# Altium schematic sheet Sheet1.SchDoc: Pumchi Musikaya
size A4; Author: Akhila Wedamestrige; DrawnBy: Akhila Wedamestrige; SheetNumber: 1; SheetTotal: 1
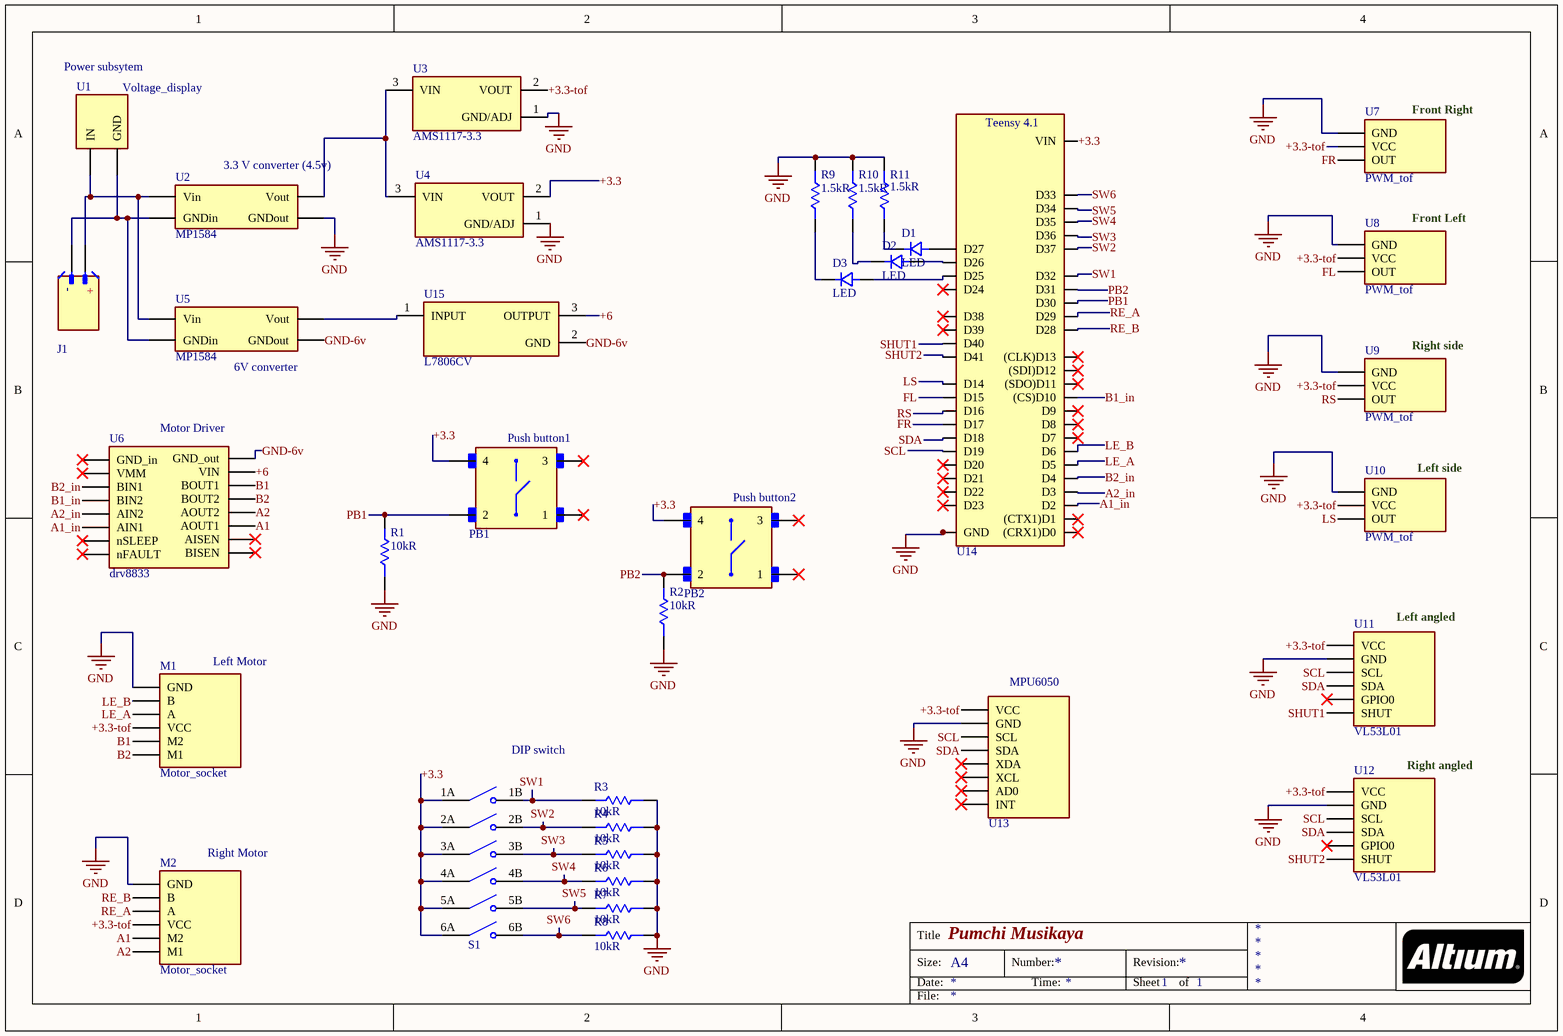
[diagram p0: Sheet1.SchDoc]

## Parts
D1  LED  [150080RS75000]
D2  LED  [150080RS75000]
D3  LED  [150080RS75000]
J1  Power_jack  [Power_jack]  (value not drawn)
M1  Motor_socket  [Motor_socket]
M2  Motor_socket  [Motor_socket]
PB1  Push_button  [Push_button]  (value not drawn)
PB2  Push_button  [Push_button]  (value not drawn)
R1  value 10kR  [RC0805JR-0710KL]  (hidden comment: RC0805JR-0710KL)
R2  value 10kR  [RC0805JR-0710KL]  (hidden comment: RC0805JR-0710KL)
R3  value 10kR  [RC0805JR-0710KL]  (hidden comment: RC0805JR-0710KL)
R4  value 10kR  [RC0805JR-0710KL]  (hidden comment: RC0805JR-0710KL)
R5  value 10kR  [RC0805JR-0710KL]  (hidden comment: RC0805JR-0710KL)
R6  value 10kR  [RC0805JR-0710KL]  (hidden comment: RC0805JR-0710KL)
R7  value 10kR  [RC0805JR-0710KL]  (hidden comment: RC0805JR-0710KL)
R8  value 10kR  [RC0805JR-0710KL]  (hidden comment: RC0805JR-0710KL)
R9  value 1.5kR  [RC0805FR-071K5L]  (hidden comment: RC0805FR-071K5L)
R10  value 1.5kR  [RC0805FR-071K5L]  (hidden comment: RC0805FR-071K5L)
R11  value 1.5kR  [RC0805FR-071K5L]  (hidden comment: RC0805FR-071K5L)
S1  DIP_switch  [DIP_switch]  (value not drawn)
U1  Voltage_display  [Voltage_display]
U2  MP1584  [MP1584]
U3  AMS1117-3.3  [AMS1117-3.3]
U4  AMS1117-3.3  [AMS1117-3.3]
U5  MP1584  [MP1584]
U6  drv8833  [drv8833]
U7  PWM_tof  [P_tof]
U8  PWM_tof  [P_tof]
U9  PWM_tof  [P_tof]
U10  PWM_tof  [P_tof]
U11  VL53L01  [VL530L01]
U12  VL53L01  [VL530L01]
U13  MPU6050  [MPU6050]  (value not drawn)
U14  teensy4.1  [teensy4.1]  (value not drawn)
U15  L7806CV  [L7806CV]

## Nets
GND: M1.GND M2.GND R1.1 R2.1 R3.1 R4.1 R5.1 R6.1 R7.1 R8.1 R9.1 R10.1 R11.1 U2.GNDout U3.1(GND/ADJ) U4.1(GND/ADJ) U7.01(GND) U8.01(GND) U9.01(GND) U10.01(GND) U11.02(GND) U12.02(GND) U13.02(GND) U14.AGND/GND(GND) U14.GND U14.GND@2(GND)
+3.3: PB1.4 PB2.4 S1.1A(COM1) S1.2A(COM2) S1.3A(COM3) S1.4A(COM4) S1.5A(COM5) S1.6A(COM6) U4.2(VOUT) U14.VIN
+3.3-tof: M1.VCC M2.VCC U3.2(VOUT) U7.02(VCC) U8.02(VCC) U9.02(VCC) U10.02(VCC) U11.01(VCC) U12.01(VCC) U13.01(VCC)
+6: U6.VIN U15.3(OUTPUT)
A1: M2.M2 U6.AOUT1
A1_in: U6.AIN1 U14.D2
A2: M2.M1 U6.AOUT2
A2_in: U6.AIN2 U14.D3
B1: M1.M2 U6.BOUT1
B1_in: U6.BIN2 U14.D10((CS)D10)
B2: M1.M1 U6.BOUT2
B2_in: U6.BIN1 U14.D4
FL: U8.03(OUT) U14.D15
FR: U7.03(OUT) U14.D17
GND-6v: U5.GNDout U6.GND_out U15.2(GND)
LE_A: M1.A U14.D5
LE_B: M1.B U14.D6
LS: U10.03(OUT) U14.D14
PB1: PB1.2 R1.2 U14.D30
PB2: PB2.2 R2.2 U14.D31
RE_A: M2.A U14.D29
RE_B: M2.B U14.D28
RS: U9.03(OUT) U14.D16
SCL: U11.03(SCL) U12.03(SCL) U13.03(SCL) U14.D19
SDA: U11.04(SDA) U12.04(SDA) U13.04(SDA) U14.D18
SHUT1: U11.06(SHUT) U14.D40
SHUT2: U12.06(SHUT) U14.D41
SW1: R3.2 S1.1B(NO1) U14.D32
SW2: R4.2 S1.2B(NO2) U14.D37
SW3: R5.2 S1.3B(NO3) U14.D36
SW4: R6.2 S1.4B(NO4) U14.D35
SW5: R7.2 S1.5B(NO5) U14.D34
SW6: R8.2 S1.6B(NO6) U14.D33
NetD1_1: D1.1 U14.D27
NetD1_2: D1.2 R11.2
NetD2_1: D2.1 U14.D26
NetD2_2: D2.2 R10.2
NetD3_1: D3.1 U14.D25
NetD3_2: D3.2 R9.2
NetJ1_1: J1.1 U1.IN U2.Vin U5.Vin
NetJ1_2: J1.2 U1.GND U2.GNDin U5.GNDin
NetU2_Vout: U2.Vout U3.3(VIN) U4.3(VIN)
NetU5_Vout: U5.Vout U15.1(INPUT)

Not connected (* = marked no-connect by the designer): PB1 1* 3*; PB2 1* 3*; U6 AISEN* BISEN* GND_in* nFAULT* nSLEEP* VMM*; U11 05(GPIO0)*; U12 05(GPIO0)*; U13 05(XDA)* 06(XCL)* 07(AD0)* 08(INT)*; U14 D0((CRX1)D0)* D1((CTX1)D1)* D7* D8* D9* D11((SDO)D11)* D12((SDI)D12)* D13((CLK)D13)* D20* D21* D22* D23* D24* D38* D39*

## Notes on the sheet
- Power subsytem
- (near U7) Front Right
- (near U2) 3.3 V converter (4.5v)
- Front Left
- (near U5) 6V converter
- (near U9) Right side
- (near U6) Motor Driver
- (near PB1) Push button1
- (near PB2) Push button2
- Left side
- (near U11) Left angled
- Left Motor
- (near U13) MPU6050
- DIP switch
- Right angled
- (near M2) Right Motor
- Title
- Size:
- Date:
- A4
- Number:
- Time:
- Revision:
- Sheet
- of
- File:
- (in symbol Power_jack) -; +
- (in symbol teensy4.1) Teensy 4.1

## Library data of the parts
D1-D3 = 150080RS75000: Single Color LED, Red, Water Clear, 1.4mm; Manufacturer: Wurth Electronics; Shape: Rectangular; Forward Current: 30mA; Luminous Intensity-Nom: 150mcd; Channels: 1; Viewing Angle: 140°; Overall Height: 0.7mm; Supplier: Digikey; Supplier Part Number: 732-4984-1-ND; Manufacturer Part Number: 150080RS75000; RoHS: Yes; Category: LEDs; Stock: 56216; Pricing: 1=0.19, 50=0.176, 100=0.151, 500=0.14688 (USD); Mounting Technology: Surface Mount; Pins: 2; Color: Red; Min Operating Temperature: -40°C; Max Operating Temperature: 85°C; Lens Style: WATER CLEAR; Optoelectronic Device Type: SINGLE COLOR LED; Packaging: Tape and Reel; Size: 1.4mm; Terminal Pitch: 2.1mm; Reach SVHC Compliant: Yes; RoHS Compliant: Yes; ComponentLink1URL: https://datasheet.ciiva.com:443/pdfs/VipMasterIC/IC/MIDC/MIDC-S-A0007455974/MIDC-S-A0007455974-1.pdf?src-supplier=IHS+Markit; ComponentLink1Description: https://datasheet.ciiva.com:443/pdfs/VipMasterIC/IC/MIDC/MIDC-S-A0007455974/MIDC-S-A0007455974-1.pdf?src-supplier=IHS+Markit; ComponentLink2URL: https://datasheet.ciiva.com/22656/150080rs75000-22656961.pdf?src-supplier=Element14; ComponentLink2Description: https://datasheet.ciiva.com/22656/150080rs75000-22656961.pdf?src-supplier=Element14; ComponentLink3URL: https://datasheet.ciiva.com/29279/759435-da-01-en-chipled-0805-w-kl-rot-150080rs75000-29279032.pdf?src-supplier=Conrad; ComponentLink3Description: https://datasheet.ciiva.com/29279/759435-da-01-en-chipled-0805-w-kl-rot-150080rs75000-29279032.pdf?src-supplier=Conrad
R1-R8 = RC0805JR-0710KL: Fixed Resistor, Metal Glaze/thick Film, 0.125W, 10000ohm, 150V, 5% +/-Tol, 100ppm/Cel, Surface Mount, 0805; Manufacturer: Yageo; Additional Feature: LASER TRIMMABLE; Power: 125mW; Rated Temperature: 70°C; Temperature Coefficient (ppm/Cel): 100; Package Height: 0.5mm; Package Length: 2mm; Package Width: 1.25mm; Supplier: Avnet; Supplier Part Number: 80K7383; Manufacturer Part Number: RC0805JR-0710KL; RoHS: Yes; Category: Chip SMD Resistors; Stock: 270; Pricing: 1=0.014, 30=0.011, 50=0.01, 100=0.008 (USD); Mounting Technology: Surface Mount; Pins: 2; Package Shape: Rectangular; Case/Package: 0805; Terminal Finish: Nickel; Min Operating Temperature: -55°C; Max Operating Temperature: 155°C; Tolerance: 5%; JESD-609 Code: e3; Resistor Type: FIXED RESISTOR; Construction: Chip; Packaging: Tape and Reel; Technology: METAL GLAZE/THICK FILM; Termination: Wraparound; Working Voltage: 150V; Reach SVHC Compliant: Yes; RoHS Compliant: Yes; ComponentLink1URL: https://datasheet.ciiva.com:443/pdfs/VipMasterIC/IC/YAGO/YAGO-S-A0008145938/YAGO-S-A0008145938-1.pdf?src-supplier=IHS+Markit; ComponentLink1Description: https://datasheet.ciiva.com:443/pdfs/VipMasterIC/IC/YAGO/YAGO-S-A0008145938/YAGO-S-A0008145938-1.pdf?src-supplier=IHS+Markit; ComponentLink2URL: https://datasheet.ciiva.com/7983/444164-7983765.pdf?src-supplier=Element14; ComponentLink2Description: https://datasheet.ciiva.com/7983/444164-7983765.pdf?src-supplier=Element14; ComponentLink3URL: https://datasheet.ciiva.com/7941/444164-7941870.pdf?src-supplier=Element14; ComponentLink3Description: https://datasheet.ciiva.com/7941/444164-7941870.pdf?src-supplier=Element14; ComponentLink4URL: https://datasheet.ciiva.com/7941/444164-7941871.pdf?src-supplier=Element14; ComponentLink4Description: https://datasheet.ciiva.com/7941/444164-7941871.pdf?src-supplier=Element14
R9-R11 = RC0805FR-071K5L: Fixed Resistor, Metal Glaze/thick Film, 0.125W, 1500ohm, 150V, 1% +/-Tol, 100ppm/Cel, Surface Mount, 0805; Manufacturer: Yageo; Additional Feature: LASER TRIMMABLE; Power: 125mW; Rated Temperature: 70°C; Temperature Coefficient (ppm/Cel): 100; Package Height: 0.5mm; Package Length: 2mm; Package Width: 1.25mm; Supplier: Digikey; Supplier Part Number: 311-1.50KCRCT-ND; Manufacturer Part Number: RC0805FR-071K5L; RoHS: Yes; Category: Chip SMD Resistors; Stock: 226709; Pricing: 1=0.1, 10=0.012, 100=0.0112, 1000=0.00918, 2500=0.00686 (USD); Mounting Technology: Surface Mount; Pins: 2; Package Shape: Rectangular; Case/Package: 0805; Terminal Finish: Nickel; Min Operating Temperature: -55°C; Max Operating Temperature: 155°C; Tolerance: 1%; JESD-609 Code: e3; Termination: Wraparound; Resistor Type: FIXED RESISTOR; Construction: Chip; Packaging: Tape and Reel; Technology: METAL GLAZE/THICK FILM; Working Voltage: 150V; Reach SVHC Compliant: Yes; RoHS Compliant: Yes; ComponentLink1URL: https://datasheet.ciiva.com:443/pdfs/VipMasterIC/IC/YAGO/YAGO-S-A0008145938/YAGO-S-A0008145938-1.pdf?src-supplier=IHS+Markit; ComponentLink1Description: https://datasheet.ciiva.com:443/pdfs/VipMasterIC/IC/YAGO/YAGO-S-A0008145938/YAGO-S-A0008145938-1.pdf?src-supplier=IHS+Markit; ComponentLink2URL: https://datasheet.ciiva.com/17423/rc0805-17423247.pdf?src-supplier=Future+Electronics; ComponentLink2Description: https://datasheet.ciiva.com/17423/rc0805-17423247.pdf?src-supplier=Future+Electronics
U7-U10 = P_tof